# Altium schematic sheet TEC power.SchDoc
size A4
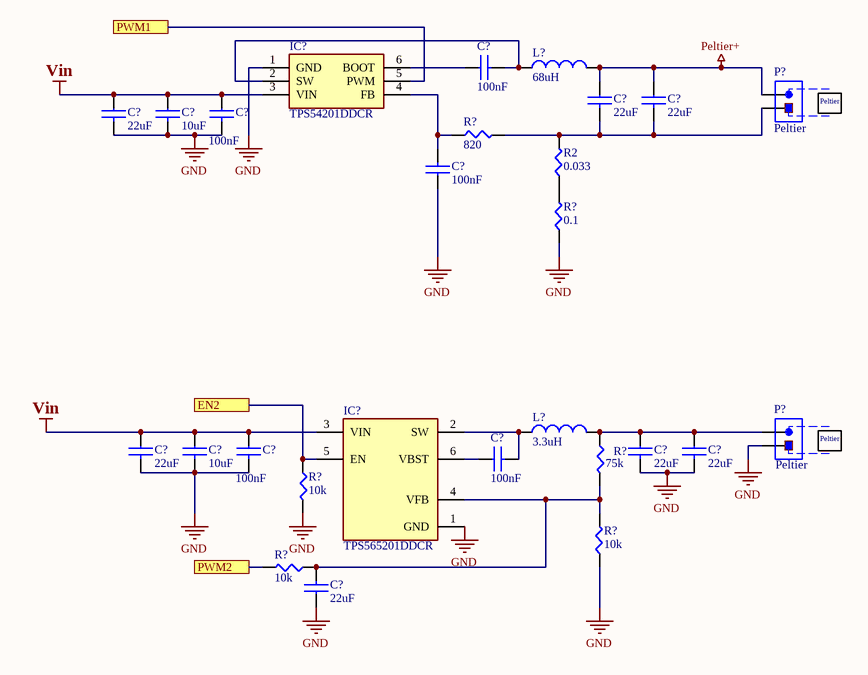
[diagram p0: TEC power.SchDoc]

## Parts
(Parts that share a designator on the sheet are numbered #1, #2 ... from top to bottom, then left to right.)
C?#1  100nF  [CAPC160X80X90L35N]
C?#2  22uF  [CAPC200X125X110L50N]
C?#3  22uF  [CAPC200X125X110L50N]
C?#4  22uF  [CAPC200X125X110L50N]
C?#5  10uF  [CAPC200X125X110L50N]
C?#6  100nF  [CAPC160X80X90L35N]
C?#7  100nF  [CAPC160X80X90L35N]
C?#8  22uF  [CAPC200X125X110L50N]
C?#9  10uF  [CAPC200X125X110L50N]
C?#10  100nF  [CAPC160X80X90L35N]
C?#11  22uF  [CAPC200X125X110L50N]
C?#12  22uF  [CAPC200X125X110L50N]
C?#13  100nF  [CAPC160X80X90L35N]
C?#14  22uF  [CAPC200X125X110L50N]
IC?#1  TPS54201DDCR  [SOT95P280X110-6N]
IC?#2  TPS565201DDCR  [SOT95P280X110-6N]
L?#1  68uH  [INDC210X125X100L50N]
L?#2  3.3uH  [INDM730X660X300L160X290N]
P?#1  Peltier  [TWO PADS]
P?#2  Peltier  [TWO PADS]
R2  0.033  [RESC200X125X70L40N]
R?#1  820  [RESC200X125X70L40N]
R?#2  0.1  [RESC310X152X65L45N]
R?#3  75k  [RESC160X80X90L30N]
R?#4  10k  [RESC160X80X90L30N]
R?#5  10k  [RESC160X80X90L30N]
R?#6  10k  [RESC160X80X90L30N]

## Ports
EN2, PWM1, PWM2

## Nets
GND: C?#4.2 C?#5.2 C?#6.2 C?#7.1 C?#8.2 C?#9.2 C?#10.2 C?#11.2 C?#12.2 C?#14.1 IC?#1.1(GND) IC?#2.1(GND) P?#2.2 R?#2.1 R?#4.2 R?#5.1
Peltier+: C?#2.1 C?#3.1 L?#1.2 P?#1.1
Vin: C?#4.1 C?#5.1 C?#6.1 C?#8.1 C?#9.1 C?#10.1 IC?#1.3(VIN) IC?#2.3(VIN)
EN2: IC?#2.5(EN) R?#4.1 ; port EN2
PWM1: IC?#1.5(PWM) ; port PWM1
PWM2: R?#6.2 ; port PWM2
NetC?#1_1: C?#1.1 IC?#1.6(BOOT)
NetC?#1_2: C?#1.2 IC?#1.2(SW) L?#1.1
NetC?#2_2: C?#2.2 C?#3.2 P?#1.2 R2.2 R?#1.2
NetC?#7_2: C?#7.2 IC?#1.4(FB) R?#1.1
NetC?#11_1: C?#11.1 C?#12.1 L?#2.2 P?#2.1 R?#3.1
NetC?#13_1: C?#13.1 IC?#2.6(VBST)
NetC?#13_2: C?#13.2 IC?#2.2(SW) L?#2.1
NetC?#14_2: C?#14.2 IC?#2.4(VFB) R?#3.2 R?#5.2 R?#6.1
NetR2_1: R2.1 R?#2.2

## Library data of the parts
C?#1 C?#6 C?#7 C?#10 C?#13 = capacitor: Part Number: CC0603KRX7R9BB104; Value: 100nF; LCSC Part #: C14663
C?#2-C?#4 C?#8 C?#11 C?#12 C?#14 = capacitor: Part Number: CL21A226MAQNNNE; Value: 22uF; LCSC Part #: C45783
C?#5 C?#9 = capacitor: Part Number: CL21A106KAYNNNE; Value: 10uF; LCSC Part #: C15850
IC?#1 = TPS54201DDCR: Integrated Circuit; Manufacturer_Name: Texas Instruments; Datasheet Link: http://www.ti.com/lit/gpn/TPS54201; Height: 1.1mm; Mouser2 Part Number: 595-TPS54201DDCR; Mouser2 Price/Stock: https://www.mouser.com/Search/Refine.aspx?Keyword=595-TPS54201DDCR; Manufacturer_Part_Number: TPS54201DDCR; Part Number: TPS54201
IC?#2 = TPS565201DDCR: Integrated Circuit; Manufacturer_Name: Texas Instruments; Datasheet Link: http://www.ti.com/lit/gpn/tps565201; Height: 1.1mm; Manufacturer_Part_Number: TPS565201DDCR
L?#1 = Inductor: Part Number: SWRB1207S-680MT; Resistance: 0.14; Value: 68uH; Package: *; LCSC Part #: C169377
L?#2 = Inductor: Part Number: MHCI06030-3R3M-R8A; Resistance: 22mOhm; Value: 3.3uH; Package: *; LCSC Part #: C280586
P?#1 P?#2 = TWO PADS for TEC: Value: 1uF
R2 = Resistor: Part Number: 0805W8F330MT5E; Value: 0.033; LCSC Part #: C127689; Package: 0805
R?#1 = Resistor: Part Number: 0805W8F8200T5E; Value: 820; LCSC Part #: C17837
R?#2 = Resistor: Part Number: 1206W4F100LT5E; Value: 0.1; LCSC Part #: C25334; Package: 1206
R?#3 = Resistor: Part Number: 0603WAF7502T5E; Value: 75k; LCSC Part #: C46216; Package: 0805
R?#4-R?#6 = Resistor: Part Number: 0805W8F250LT5F; Value: 10k; LCSC Part #: C46216; Package: 0805